# Altium schematic sheet GALX4-0047N_PCB-1109N_REV-A_Micro.SchDoc
size 431 x 279 mm; SheetNumber: 1; SheetTotal: 1; DocumentName: Sheet1.SCHDOC
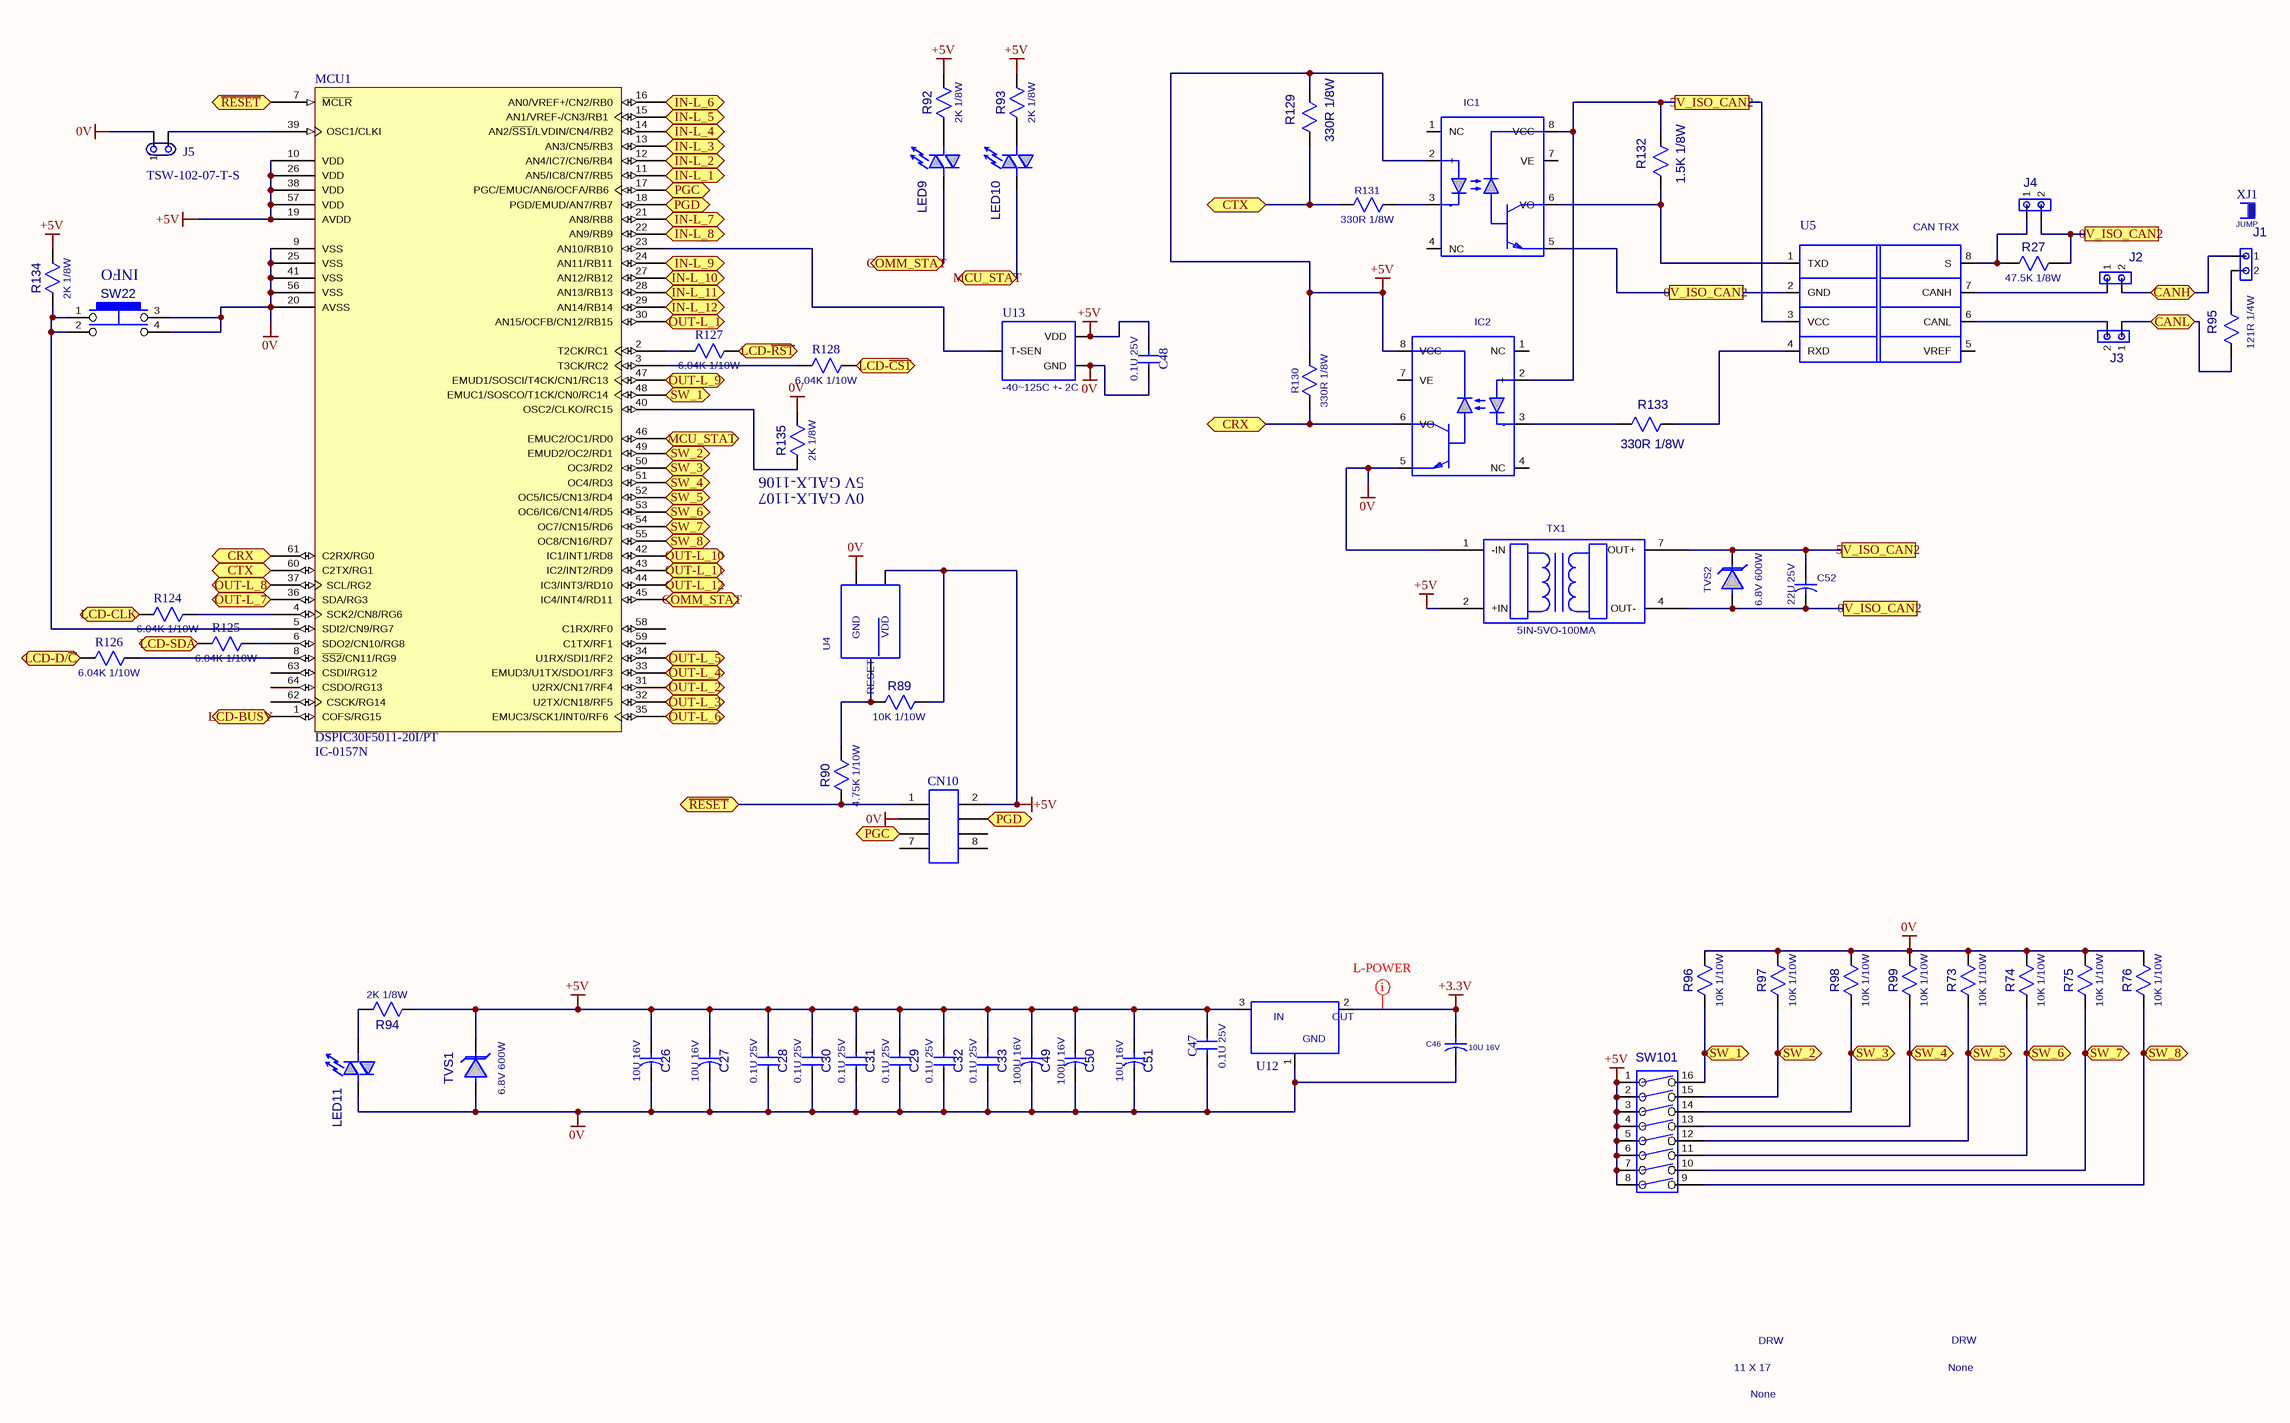
[diagram p0: GALX4-0047N_PCB-1109N_REV-A_Micro.SchDoc]

## Parts
C26  value 10U 16V  [1206POL]  (hidden comment: CAP-0102N)
C27  value 10U 16V  [1206POL]  (hidden comment: CAP-0102N)
C28  value 0.1U 25V  [0603]  (hidden comment: CAP-0112N)
C29  value 0.1U 25V  [0603]  (hidden comment: CAP-0112N)
C30  value 0.1U 25V  [0603]  (hidden comment: CAP-0112N)
C31  value 0.1U 25V  [0603]  (hidden comment: CAP-0112N)
C32  value 0.1U 25V  [0603]  (hidden comment: CAP-0112N)
C33  value 0.1U 25V  [0603]  (hidden comment: CAP-0112N)
C46  value 10U 16V  [1206POL]  (hidden comment: CAP-0102N)
C47  value 0.1U 25V  [0603]  (hidden comment: CAP-0112N)
C48  value 0.1U 25V  [0603]  (hidden comment: CAP-0112N)
C49  value 100U 16V  [D6.3]  (hidden comment: CAP-0120N)
C50  value 100U 16V  [D6.3]  (hidden comment: CAP-0120N)
C51  value 10U 16V  [1206POL]  (hidden comment: CAP-0102N)
C52  value 22U 25V  [D6.3]  (hidden comment: CAP-0097N)
CN10  CONN-0220N  [SCKT-4POS8PINDUALROWSMT]  (value not drawn)
IC1  IC-0114N  [SMD8]  (value not drawn)
IC2  IC-0114N  [SMD8]  (value not drawn)
J1  CONN-0295N  [JUMPER-2POS-SMT]  (value not drawn)
J2  CONN-0295N  [JUMPER-2POS-SMT]  (value not drawn)
J3  CONN-0295N  [JUMPER-2POS-SMT]  (value not drawn)
J4  CONN-0295N  [JUMPER-2POS-SMT]  (value not drawn)
J5  TSW-102-07-T-S  [TSW-102-07-T-S]
LED9  LED-0014N  [1206-LED-RED]  (value not drawn)
LED10  LED-0014N  [1206-LED-RED]  (value not drawn)
LED11  LED-0013N  [1206-LED-GREEN]  (value not drawn)
MCU1  IC-0157N  value DSPIC30F5011-20I/PT  [TQFP-64_N]
R27  value 47.5K 1/8W  [0805]  (hidden comment: RES-0280N)
R73  value 10K 1/10W  [0603]  (hidden comment: RES-0314N)
R74  value 10K 1/10W  [0603]  (hidden comment: RES-0314N)
R75  value 10K 1/10W  [0603]  (hidden comment: RES-0314N)
R76  value 10K 1/10W  [0603]  (hidden comment: RES-0314N)
R89  value 10K 1/10W  [0603]  (hidden comment: RES-0314N)
R90  value 4.75K 1/10W  [0603]  (hidden comment: RES-0317N)
R92  value 2K 1/8W  [0805]  (hidden comment: RES-0272N)
R93  value 2K 1/8W  [0805]  (hidden comment: RES-0272N)
R94  value 2K 1/8W  [0805]  (hidden comment: RES-0272N)
R95  value 121R 1/4W  [1206]  (hidden comment: RES-0269N)
R96  value 10K 1/10W  [0603]  (hidden comment: RES-0314N)
R97  value 10K 1/10W  [0603]  (hidden comment: RES-0314N)
R98  value 10K 1/10W  [0603]  (hidden comment: RES-0314N)
R99  value 10K 1/10W  [0603]  (hidden comment: RES-0314N)
R124  value 6.04K 1/10W  [0603]  (hidden comment: RES-0360N)
R125  value 6.04K 1/10W  [0603]  (hidden comment: RES-0360N)
R126  value 6.04K 1/10W  [0603]  (hidden comment: RES-0360N)
R127  value 6.04K 1/10W  [0603]  (hidden comment: RES-0360N)
R128  value 6.04K 1/10W  [0603]  (hidden comment: RES-0360N)
R129  value 330R 1/8W  [0805]  (hidden comment: RES-0291N)
R130  value 330R 1/8W  [0805]  (hidden comment: RES-0291N)
R131  value 330R 1/8W  [0805]  (hidden comment: RES-0291N)
R132  value 1.5K 1/8W  [0805]  (hidden comment: RES-0293N)
R133  value 330R 1/8W  [0805]  (hidden comment: RES-0291N)
R134  value 2K 1/8W  [0805]  (hidden comment: RES-0272N)
R135  value 2K 1/8W  [0805]  (hidden comment: RES-0272N)
SW22  SW-0071N  [PB_500X500-TH]  (value not drawn)
SW101  SW-0072N  [SMD-8DIPSWITCH]  (value not drawn)
TVS1  value 6.8V 600W  [SMB]  (hidden comment: DIOD-0086N)
TVS2  value 6.8V 600W  [SMB]  (hidden comment: DIOD-0086N)
TX1  value 5IN-5VO-100MA  [DC-DC-RECOM-0.5W-SMT]  (hidden comment: IC-0148N)
U4  IC-0112N  [SOIC8]  (value not drawn)
U5  value CAN TRX  [SOIC8]  (hidden comment: IC-0111N)
U12  IC-0163N  [DPAK]  (value not drawn)
U13  value -40~125C +- 2C  [SOT-23]  (hidden comment: IC-0183N)
XJ1  value JUMP  (hidden comment: CONN-0092N)  (mechanical)

## Ports
0V_ISO_CAN2, 5V_ISO_CAN2, CANH (bidir), CANL (bidir), COMM_STAT (bidir), CRX (bidir), CTX (bidir), IN-L_1 (bidir), IN-L_2 (bidir), IN-L_3 (bidir), IN-L_4 (bidir), IN-L_5 (bidir), IN-L_6 (bidir), IN-L_7 (bidir), IN-L_8 (bidir), IN-L_9 (bidir), IN-L_10 (bidir), IN-L_11 (bidir), IN-L_12 (bidir), LCD-BUSY (bidir), LCD-CLK (bidir), LCD-D/~{C} (bidir), LCD-SDA (bidir), LCD-~{CS1} (bidir), LCD-~{RST} (bidir), MCU_STAT (bidir), OUT-L_1 (bidir), OUT-L_2 (bidir), OUT-L_3 (bidir), OUT-L_4 (bidir), OUT-L_5 (bidir), OUT-L_6 (bidir), OUT-L_7 (bidir), OUT-L_8 (bidir), OUT-L_9 (bidir), OUT-L_10 (bidir), OUT-L_11 (bidir), OUT-L_12 (bidir), PGC (bidir), PGD (bidir), SW_1 (bidir), SW_2 (bidir), SW_3 (bidir), SW_4 (bidir), SW_5 (bidir), SW_6 (bidir), SW_7 (bidir), SW_8 (bidir), ~{RESET} (bidir)

## Nets
0V: C26.2 C27.2 C28.2(B) C29.2(B) C30.2(B) C31.2(B) C32.2(B) C33.2(B) C46.2 C47.1(A) C48.2(B) C49.2 C50.2 C51.2 CN10.3 IC2.5(GND) J5.1 LED11.1 MCU1.9(VSS) MCU1.20(AVSS) MCU1.25(VSS) MCU1.41(VSS) MCU1.56(VSS) R73.2 R74.2 R75.2 R76.2 R96.2 R97.2 R98.2 R99.2 R135.2 SW22.3 SW22.4 TVS1.1 TX1.1(-IN) U4.4 U12.1 U13.2(GND)
+3.3V: C46.1 U12.2
+5V: C26.1 C27.1 C28.1(A) C29.1(A) C30.1(A) C31.1(A) C32.1(A) C33.1(A) C47.2(B) C48.1(A) C49.1 C50.1 C51.1 CN10.2 IC1.2(+) IC2.8(VCC) MCU1.10(VDD) MCU1.19(AVDD) MCU1.26(VDD) MCU1.38(VDD) MCU1.57(VDD) R89.2 R92.2 R93.2 R94.1 R129.2 R130.2 R134.2 SW101.1 SW101.2 SW101.3 SW101.4 SW101.5 SW101.6 SW101.7 SW101.8 TVS1.2 TX1.2(+IN) U4.2 U12.3 U13.1(VDD)
0V_ISO_CAN2: C52.2 IC1.5(GND) J4.2 R27.2 TVS2.1 TX1.4(OUT-) U5.2(GND) ; port 0V_ISO_CAN2
5V_ISO_CAN2: C52.1 IC1.8(VCC) IC2.2(+) R132.2 TVS2.2 TX1.7(OUT+) U5.3(VCC) ; port 5V_ISO_CAN2
CANH: J1.1 J2.2 ; port CANH
CANL: J3.1 R95.1 ; port CANL
COMM_STAT: LED9.1 MCU1.45(IC4/INT4/RD11) ; port COMM_STAT
CRX: IC2.6(VO) MCU1.61(C2RX/RG0) R130.1 ; port CRX
CTX: MCU1.60(C2TX/RG1) R129.1 R131.1 ; port CTX
IN-L_1: MCU1.11(AN5/IC8/CN7/RB5) ; port IN-L_1
IN-L_2: MCU1.12(AN4/IC7/CN6/RB4) ; port IN-L_2
IN-L_3: MCU1.13(AN3/CN5/RB3) ; port IN-L_3
IN-L_4: MCU1.14(AN2/~{SS1}/LVDIN/CN4/RB2) ; port IN-L_4
IN-L_5: MCU1.15(AN1/VREF-/CN3/RB1) ; port IN-L_5
IN-L_6: MCU1.16(AN0/VREF+/CN2/RB0) ; port IN-L_6
IN-L_7: MCU1.21(AN8/RB8) ; port IN-L_7
IN-L_8: MCU1.22(AN9/RB9) ; port IN-L_8
IN-L_9: MCU1.24(AN11/RB11) ; port IN-L_9
IN-L_10: MCU1.27(AN12/RB12) ; port IN-L_10
IN-L_11: MCU1.28(AN13/RB13) ; port IN-L_11
IN-L_12: MCU1.29(AN14/RB14) ; port IN-L_12
LCD-BUSY: MCU1.1(COFS/RG15) ; port LCD-BUSY
LCD-~{CS1}: R128.2 ; port LCD-~{CS1}
LCD-CLK: R124.1 ; port LCD-CLK
LCD-D/~{C}: R126.1 ; port LCD-D/~{C}
LCD-~{RST}: R127.2 ; port LCD-~{RST}
LCD-SDA: R125.1 ; port LCD-SDA
MCU_STAT: LED10.1 MCU1.46(EMUC2/OC1/RD0) ; port MCU_STAT
OUT-L_1: MCU1.30(AN15/OCFB/CN12/RB15) ; port OUT-L_1
OUT-L_2: MCU1.31(U2RX/CN17/RF4) ; port OUT-L_2
OUT-L_3: MCU1.32(U2TX/CN18/RF5) ; port OUT-L_3
OUT-L_4: MCU1.33(EMUD3/U1TX/SDO1/RF3) ; port OUT-L_4
OUT-L_5: MCU1.34(U1RX/SDI1/RF2) ; port OUT-L_5
OUT-L_6: MCU1.35(EMUC3/SCK1/INT0/RF6) ; port OUT-L_6
OUT-L_7: MCU1.36(SDA/RG3) ; port OUT-L_7
OUT-L_8: MCU1.37(SCL/RG2) ; port OUT-L_8
OUT-L_9: MCU1.47(EMUD1/SOSCI/T4CK/CN1/RC13) ; port OUT-L_9
OUT-L_10: MCU1.42(IC1/INT1/RD8) ; port OUT-L_10
OUT-L_11: MCU1.43(IC2/INT2/RD9) ; port OUT-L_11
OUT-L_12: MCU1.44(IC3/INT3/RD10) ; port OUT-L_12
PGC: CN10.5 MCU1.17(PGC/EMUC/AN6/OCFA/RB6) ; port PGC
PGD: CN10.4 MCU1.18(PGD/EMUD/AN7/RB7) ; port PGD
~{RESET}: CN10.1 MCU1.7(~{MCLR}) R90.1 ; port ~{RESET}
SW_1: MCU1.48(EMUC1/SOSCO/T1CK/CN0/RC14) R96.1 SW101.16 ; port SW_1
SW_2: MCU1.49(EMUD2/OC2/RD1) R97.1 SW101.15 ; port SW_2
SW_3: MCU1.50(OC3/RD2) R98.1 SW101.14 ; port SW_3
SW_4: MCU1.51(OC4/RD3) R99.1 SW101.13 ; port SW_4
SW_5: MCU1.52(OC5/IC5/CN13/RD4) R73.1 SW101.12 ; port SW_5
SW_6: MCU1.53(OC6/IC6/CN14/RD5) R74.1 SW101.11 ; port SW_6
SW_7: MCU1.54(OC7/CN15/RD6) R75.1 SW101.10 ; port SW_7
SW_8: MCU1.55(OC8/CN16/RD7) R76.1 SW101.9 ; port SW_8
NetIC1_3: IC1.3(-) R131.2
NetIC1_6: IC1.6(VO) R132.1 U5.1(TXD)
NetIC2_3: IC2.3(-) R133.1
NetJ1_2: J1.2 R95.2
NetJ2_1: J2.1 U5.7(CANH)
NetJ3_2: J3.2 U5.6(CANL)
NetJ4_1: J4.1 R27.1 U5.8(S)
NetJ5_2: J5.2 MCU1.39(OSC1/CLKI)
NetLED9_2: LED9.2 R92.1
NetLED10_2: LED10.2 R93.1
NetLED11_2: LED11.2 R94.2
NetMCU1_2: MCU1.2(T2CK/RC1) R127.1
NetMCU1_3: MCU1.3(T3CK/RC2) R128.1
NetMCU1_4: MCU1.4(SCK2/CN8/RG6) R124.2
NetMCU1_5: MCU1.5(SDI2/CN9/RG7) R134.1 SW22.1 SW22.2
NetMCU1_6: MCU1.6(SDO2/CN10/RG8) R125.2
NetMCU1_8: MCU1.8(~{SS2}/CN11/RG9) R126.2
NetMCU1_23: MCU1.23(AN10/RB10) U13.3(T-SEN)
NetMCU1_40: MCU1.40(OSC2/CLKO/RC15) R135.1
NetR89_1: R89.1 R90.2 U4.1
NetR133_2: R133.2 U5.4(RXD)

Not connected (* = marked no-connect by the designer): CN10 6 7 8; IC1 1(NC) 4(NC) 7(VE); IC2 1(NC) 4(NC) 7(VE); MCU1 58(C1RX/RF0) 59(C1TX/RF1) 62(CSCK/RG14) 63(CSDI/RG12) 64(CSDO/RG13); SW22 5 6; U5 5(VREF)

## Layout directives
net class L-POWER: +3.3V

## Notes on the sheet
- INFO
- (near R135) 5V GALX-1106
- (near R135) 0V GALX-1107
- DRW
- 11 X 17
- None
- TITLE:
- S
- DWG BY
- E
- L
- V
- A
- T
- O
- R
- D
- I
- C
- 50 EAST 153rd STREET
- ENGINEER
- DWG. No.
- BRONX, N.Y. 10451
- REV
- DESCRIPTION
- ECN NO.
- DATE
- SIZE
- SCALE
- PART No.
- FILE NAME
- SHEET __ 0F __
- REV.
- (in symbol IC-0112N) GND; VDD; RESET
- (in symbol IC-0163N) IN; OUT; GND

## Library data of the parts
C26 C27 C46 C51 = CAP-0102N: C-1206-P-D-10U-16V-10%; MANUFACTURER: AVX; MFG PART ID: TAJA106K016R; GAL DESC.: CAP , 10UF 16V TANT 10% 1206 SMT; PLACE: S; UNIT $: $0.1533; GAL P/N: CAP-0102N; PART TYPE: 1206POL; VENDOR: *; VENDOR ID: *
C28-C33 C47 C48 = CAP-0112N: C-0603-D-0.1U-25V-10%; MANUFACTURER: KEMET; MFG PART ID: C0603C104K3RACTU; GAL DESC.: CAP, 0.1UF 25V 10% CERM 0603 SMT; PLACE: S; UNIT $: $0.0087; GAL P/N: CAP-0112N; PART TYPE: 0603-020; VENDOR: *; VENDOR ID: *
C49 C50 = CAP-0120N: C-D6.3-D-100U-16V-20%; MANUFACTURER: UNITED CHEMI-CON; MFG PART ID: EMVY160ADA101MF55G; GAL DESC.: CAP, 100UF 16V 20% 6.3MM ELECT SMT; PLACE: S; UNIT $: $0.0800; GAL P/N: CAP-0120N; PART TYPE: ALUM_D; VENDOR: *; VENDOR ID: *
C52 = CAP-0097N: C-D6.3-D-22U-25V-20%; MANUFACTURER: NICHICON; MFG PART ID: UWT1E220MCL1GB; GAL DESC.: CAP, 22UF 25V 20% 6.3MM ELECT SMT; PLACE: S; UNIT $: $0.0854; GAL P/N: CAP-0097N; PART TYPE: ALUM_D; VENDOR: *; VENDOR ID: *
CN10 = CONN-0220N: SCKT-2X4-.1PITCH; MANUFACTURER: SAMTEC; MFG PART ID: SSM-104-22-F-D-VS-K-TR; UNIT $: $0.2730; PLACE: S; GAL DESC.: CONN,SCKT(F) 8P 2X4POS .100" .290"H SMT; VENDOR: *; PART TYPE: CONN-0220N; GAL P/N: CONN-0220N; VENDOR ID: *; Value: *
IC1 IC2 = IC-0114N: OPTOISO-1CH-HS-SMD8; MANUFACTURER: FAIRCHILD SEMI; Value: 6N137S; GAL DESC.: OPTOCOUPLER,LOG-OUT HS SMD 8DIP SMT; PLACE: S; UNIT $: $0.4000; MFG PART ID: 6N137S; VENDOR ID: *; VENDOR: *; GAL P/N: IC-0114N; PART TYPE: SMD8
J1-J4 = CONN-0295N: HEADER_2POS_100MIL_SMT; MANUFACTURER: SAMTEC; MFG PART ID: ASP-152787-01; UNIT $: $0.1990; PLACE: S; GAL DESC.: HEADER, 2 POS. 0.100 STRIP HIGH TEMP SMT; Value: *; VENDOR: *; PART TYPE: CONN-0295N; GAL P/N: CONN-0295N; VENDOR ID: *
J5 = CONN-2 POS HEADER: CONN 2 POS HEADER .100"; MANUFACTURER: SAMTEC; PLACE: PTP; GAL DESC.: CONN 2 POS HEADER .100"; MFG PART ID: TSW-102-07-T-S; PART TYPE: TSW; RoHs COMPLIANT: YES; TEMPERATURE: -55°C to +105°C; Value: 2 POS HEADER .100"
LED9 LED10 = LED-0014N: LED-1206-BI-R; MANUFACTURER: SUNLED; MFG PART ID: XZMDKMDK55W-7; Value: RED; GAL DESC.: LED RED BI-POLAR DOME LENS 1206 SMT; PLACE: S; UNIT $: $0.1380; GAL P/N: LED-0014N; PART TYPE: 1206LED; VENDOR: SUNLED; VENDOR ID: LED-0014N
LED11 = LED-0013N: LED-1206-BI-G; MANUFACTURER: SUNLED; MFG PART ID: XZSGKSGK55W-7; Value: GREEN; GAL DESC.: LED,GREEN BI-POLAR DOME LENS 1206 SMT; PLACE: S; UNIT $: $0.2260; GAL P/N: LED-0013N; PART TYPE: 1206LED; VENDOR: SUNLED; VENDOR ID: LED-0013N
MCU1 = IC-0157N: MCU-DSPIC30F5011-20I/PT; MANUFACTURER: MICROCHIP; PLACE: S; GAL DESC.: IC,DSPIC MCU/DSP 66K 64TQFP SMT; UNIT $: $4.0000; MFG PART ID: DSPIC30F5011-20I/PT; GAL P/N: IC-0157N; VENDOR: MICROCHIP; PART TYPE: QFP64-10X10; VENDOR ID: *
R27 = RES-0280N: R-0805-B-47.5K-1/8-1%; MANUFACTURER: KOA SPEER; MFG PART ID: RK73H2ATTD4752F; PLACE: S; GAL DESC.: RESISTOR,47.5KOHM 1/8W 1% 0805 SMT; UNIT $: $0.0050; GAL P/N: RES-0280N; PART TYPE: 0805; VENDOR: *; VENDOR ID: *
R73-R76 R89 R96-R99 = RES-0314N: R-0603-B-10.0K-1/10-5%; MANUFACTURER: PANASONIC-ECG; MFG PART ID: ERJ-3GEYJ103V; PLACE: S; GAL DESC.: RES, 10.0KOHM 1/10W 5% 0603 SMT; UNIT $: $0.0024; GAL P/N: RES-0314N; PART TYPE: 0603; VENDOR: *; VENDOR ID: *
R90 = RES-0317N: R-0603-B-4.75K-1/10-1%; MANUFACTURER: PANASONIC-ECG; MFG PART ID: ERJ-3EKF4751V; PLACE: S; GAL DESC.: RES, 4.75KOHM 1/10W 1% 0603 SMT; UNIT $: $0.0034; GAL P/N: RES-0317N; PART TYPE: 0603; VENDOR: *; VENDOR ID: *
R92-R94 R134 R135 = RES-0272N: R-0805-B-2.0K-1/8-5%; MANUFACTURER: KOA SPEER; MFG PART ID: RK73B2ATTD202J; PLACE: S; GAL DESC.: RESISTOR,2KOHM 1/8W 5% 0805 SMT; UNIT $: $0.0038; GAL P/N: RES-0272N; PART TYPE: 0805; VENDOR: *; VENDOR ID: *
R95 = RES-0269N: R-1206-A-121R-1/4-1%; MANUFACTURER: VISHAY/DALE; MFG PART ID: CRCW1206121RFKEA; PLACE: S; GAL DESC.: RESISTOR,121OHM 1/4W 1% 1206 SMT; UNIT $: $0.0090; GAL P/N: RES-0269N; PART TYPE: 1206; VENDOR: *; VENDOR ID: *
R124-R128 = RES-0360N: R-0603-B-6.04K-1/10-1%; MANUFACTURER: VISHAY/DALE; MFG PART ID: CRCW06036K04FKEA; PLACE: S; GAL DESC.: RES, 6.04KOHM 1/10W 1% 0603 SMT; UNIT $: $0.0060; GAL P/N: RES-0360N; PART TYPE: 0603; VENDOR: *; VENDOR ID: *
R129-R131 R133 = RES-0291N: R-0805-A-330R-1/8-5%; MANUFACTURER: KOA SPEER; MFG PART ID: RK73B2ATTD331J; PLACE: S; GAL DESC.: RESISTOR,330OHM 1/8W 5% 0805 SMT; UNIT $: $0.0038; GAL P/N: RES-0291N; PART TYPE: 0805; VENDOR: *; VENDOR ID: *
R132 = RES-0293N: R-0805-B-1.5K-1/8-1%; MANUFACTURER: KOA SPEER; MFG PART ID: RK73H2ATTD1501F; PLACE: S; GAL DESC.: RESISTOR,1.5KOHM 1/8W 1% 0805 SMT; UNIT $: $0.0060; GAL P/N: RES-0293N; PART TYPE: 0805; VENDOR: *; VENDOR ID: *
SW22 = SW-0071N: PB_500X500-TH; MANUFACTURER: OMRON; MFG PART ID: B3W-4050; GAL DESC.: SWITCH PUSHBUT TACT 12MM MOM 200GF SEALD; PLACE: M; UNIT $: $0.3000; Value: *; GAL P/N: SW-0071N; PART TYPE: PB
SW101 = SW-0072N: DIPSW-8CH-SMT; MANUFACTURER: ESWITCH; MFG PART ID: KAJ08TGGR; UNIT $: $0.6000; PLACE: S; GAL DESC.: SWITCH DIP LOW PROFILE 8POS SMT; VENDOR: *; PART TYPE: SMD16-SW; GAL P/N: SW-0072N; VENDOR ID: *; Value: *
TVS1 TVS2 = DIOD-0086N: TVS-6.8V-600W-SMB; MANUFACTURER: ON SEMI; MFG PART ID: P6SMB6.8AT3G; GAL DESC.: DIODE,TVS ZENER UNIDIR 600W 6.8V SMB SMT; PLACE: S; UNIT $: $0.1000; GAL P/N: DIOD-0086N; PART TYPE: SMB; VENDOR: *; VENDOR ID: *
TX1 = IC-0148N: DC-DC-5VIN-5VO-RECOM-0.5W-SMT; MANUFACTURER: RECOM; MFG PART ID: RZ-0505S/P; UNIT $: $6.6053; PLACE: S; GAL DESC.: IC,DC-DC 1/2W SNGL OUT 5-5VDC SMT; VENDOR: *; PART TYPE: IC-0148N; GAL P/N: IC-0148N; VENDOR ID: *
U4 = IC-0112N: RESETGEN-5V-SOIC; MFG PART ID: MC34064D-5R2G; MANUFACTURER: ON-SEMI; Value: 5V LOW V RESET GEN; GAL DESC.: IC SENSOR UNDERVOLTAGE 8SOIC SMT; PLACE: S; UNIT $: $0.2400; VENDOR ID: *; VENDOR: *; GAL P/N: IC-0112N; PART TYPE: SOIC8
U5 = IC-0111N: CAN_TRX-SOIC8; MFG PART ID: PCA82C251TD-T; MANUFACTURER: PHILIPS; GAL DESC.: IC, CAN TRANSCEIVER 5V HS 8-SOIC SMT; PLACE: S; UNIT $: $0.7800; VENDOR ID: *; VENDOR: *; GAL P/N: IC-0111N; PART TYPE: SOIC8
U12 = IC-0163N: VREG-3.3VO-1A-DPAK; MFG PART ID: FAN1117AD33X; MANUFACTURER: FAIRCHILD SEMI; Value: 3.3VO 1A; GAL DESC.: IC, REG LDO 1A 3.3V TO-252 DPAK SMT; PLACE: S; UNIT $: $0.3800; VENDOR ID: *; VENDOR: *; GAL P/N: IC-0163N; PART TYPE: DPAK
U13 = IC-0183N: TEMPSENSE-M45TO120C-SOT23; MFG PART ID: MCP9701AT-E/TT; MANUFACTURER: MICROCHIP; GAL DESC.: IC,TEMP SENS -40~125C 3.1-5.5V SOT23 SMT; PLACE: S; UNIT $: $0.2400; VENDOR ID: *; VENDOR: *; GAL P/N: IC-0183N; PART TYPE: SOT23
XJ1 = CONN-0092N: JUMPER_BLUE; MANUFACTURER: 3M; MFG PART ID: 929955-06; UNIT $: $0.1550; PLACE: M; GAL DESC.: JUMPER,2 POS .100 SHORT GLD/NICKEL BLUE; VENDOR: *; PART TYPE: CONN-0092N; GAL P/N: CONN-0092N; VENDOR ID: *